# Altium schematic sheet Block_Diagram.SchDoc
size A4; PageSetup: Record=PageOptions|CenterHorizontal=True|CenterVertical=True|PrintScale=0.92|XCorrection=1.00|YCorrection=1.00|PrintKind=0|BorderSize=5000000|LeftOffset=0|BottomOffset=0|Orientation=2|PaperLength=1000|PaperWidth=1000|Scale=100|PaperSource=7|PrintQuality=-4|MediaType=1|DitherType=10|PrintScaleMode=1|PaperKind=A4; CompanyName: Technische Hochschule Nürnberg Georg Simon Ohm; Organization: UltraZohm; Address1: Kesslerplatz 12; Address2: 90489 Nürnberg; Address3: GERMANY; SheetNumber: 41; Website: www.ultrazohm.com
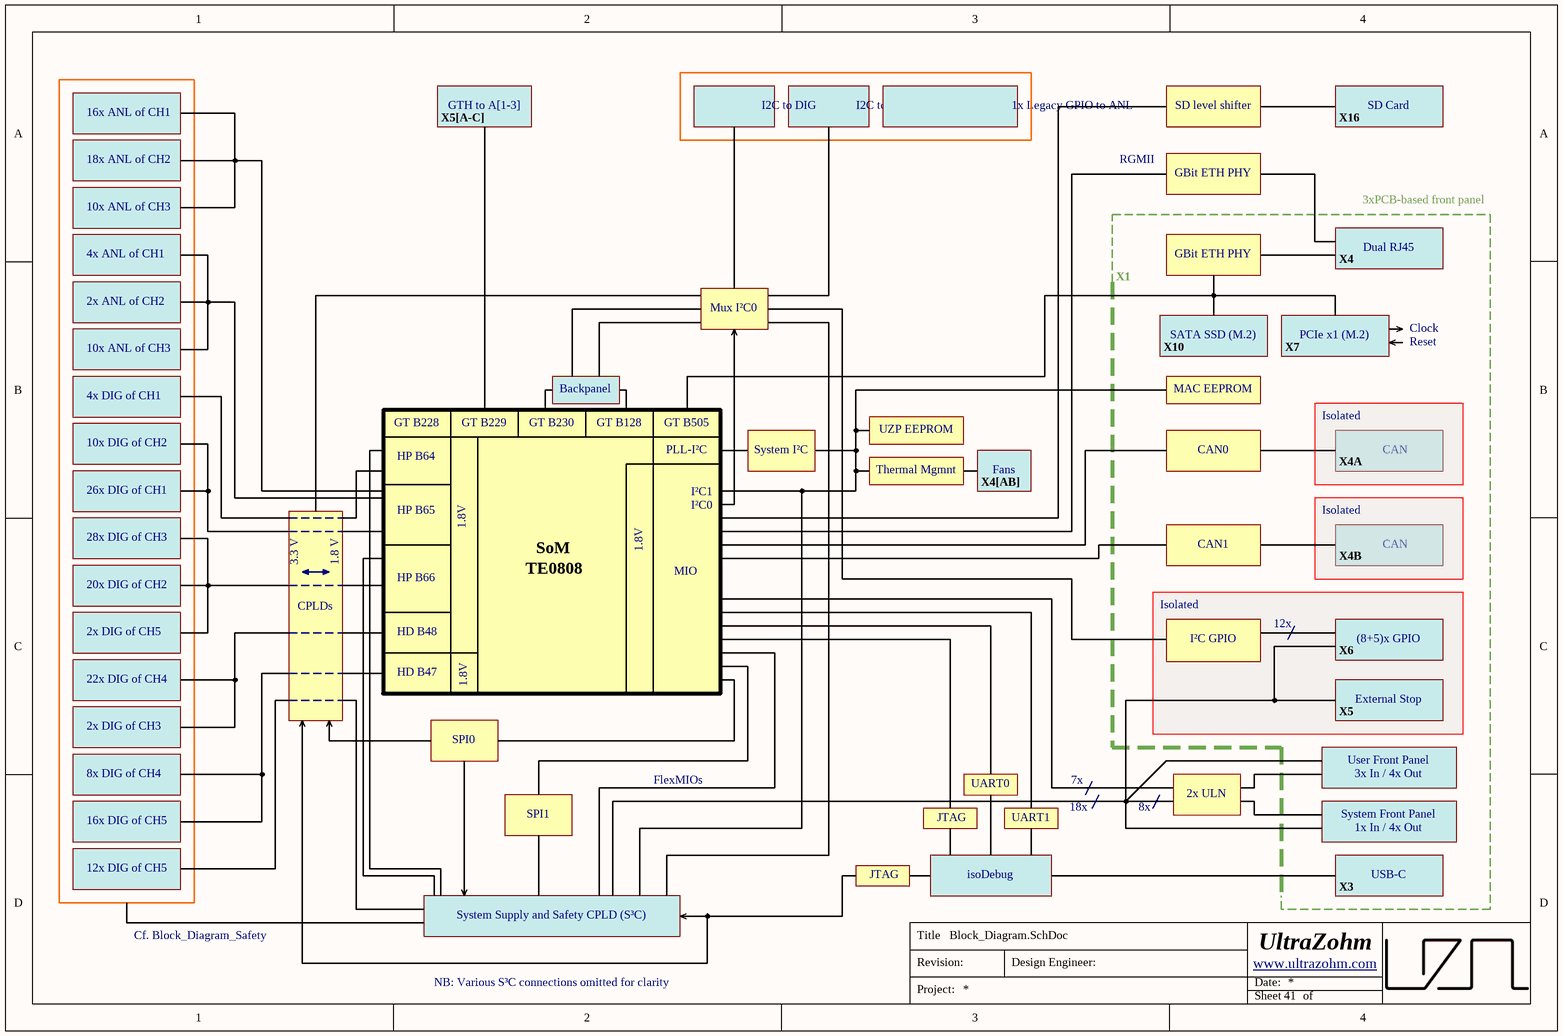
[diagram p0: Block_Diagram.SchDoc]

## Notes on the sheet
- 16x ANL of CH1
- GTH to A[1-3]
- I2C to DIG
- I2C to ANL
- 1x Legacy GPIO to ANL
- SD level shifter
- SD Card
- 18x ANL of CH2
- X5[A-C]
- RGMII
- GBit ETH PHY
- X16
- 10x ANL of CH3
- 3xPCB-based front panel
- Dual RJ45
- 4x ANL of CH1
- 2x ANL of CH2
- Mux I²C0
- X1
- X4
- X10
- SATA SSD (M.2)
- X7
- PCIe x1 (M.2)
- Clock
- Reset
- 4x DIG of CH1
- 10x DIG of CH2
- GT B228
- GT B229
- GT B230
- Backpanel
- GT B128
- GT B505
- UZP EEPROM
- MAC EEPROM
- Isolated
- 26x DIG of CH1
- HP B64
- HP B65
- PLL-I²C
- I²C1
- I²C0
- System I²C
- Thermal Mgmnt
- X4[AB]
- Fans
- CAN0
- X4A
- CAN
- 28x DIG of CH3
- 3.3 V
- 1.8 V
- HP B66
- 1.8V
- TE0808
- SoM
- MIO
- CAN1
- X4B
- 20x DIG of CH2
- 2x DIG of CH5
- CPLDs
- HD B48
- I²C GPIO
- 12x
- X6
- (8+5)x GPIO
- 22x DIG of CH4
- HD B47
- X5
- External Stop
- 8x DIG of CH4
- 2x DIG of CH3
- SPI0
- FlexMIOs
- UART0
- 7x
- User Front Panel
- 3x In / 4x Out
- 16x DIG of CH5
- SPI1
- JTAG
- UART1
- 18x
- 8x
- 2x ULN
- System Front Panel
- 1x In / 4x Out
- 12x DIG of CH5
- System Supply and Safety CPLD (S³C)
- isoDebug
- X3
- USB-C
- Cf. Block_Diagram_Safety
- NB: Various S³C connections omitted for clarity
- Title
- Revision:
- Design Engineer:
- Date:
- Project:
- Sheet
- of